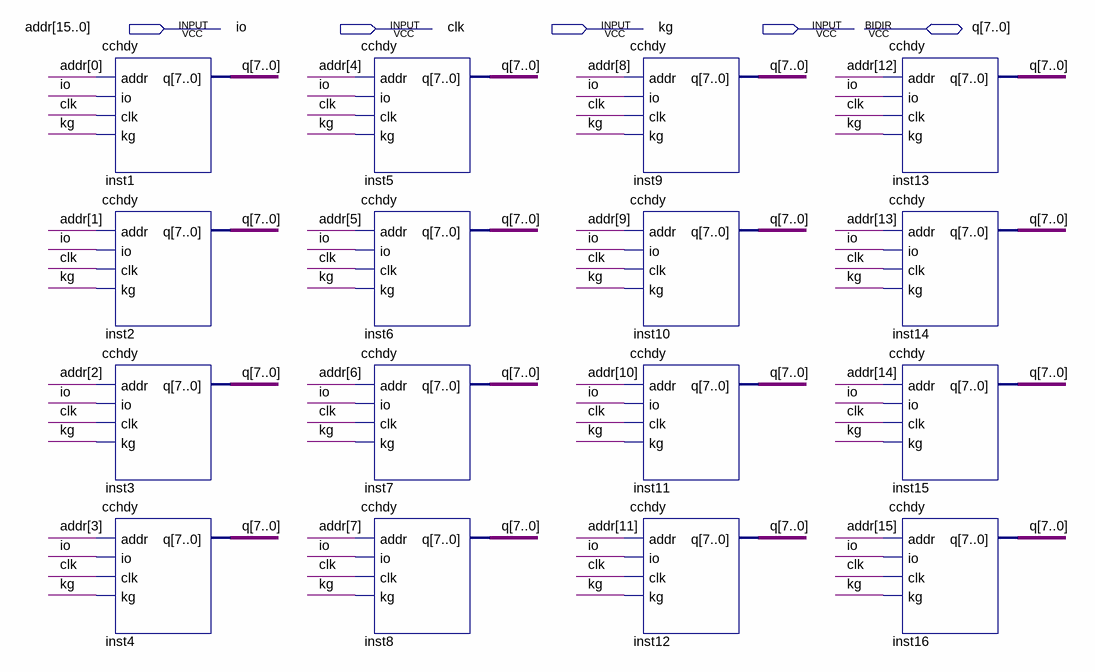
[diagram p0: schematic sheet]
// Quartus schematic cchq16.bdf as structural Verilog: 16 symbols, 5 pins
module cchq16 (
  input  [15:0] addr,
  input  io,
  input  clk,
  input  kg,
  inout  [7:0] q
);

  cchdy inst1 (.addr(addr[0]), .io(io), .clk(clk), .kg(kg), .q(q));
  cchdy inst2 (.addr(addr[1]), .io(io), .clk(clk), .kg(kg), .q(q));
  cchdy inst3 (.addr(addr[2]), .io(io), .clk(clk), .kg(kg), .q(q));
  cchdy inst4 (.addr(addr[3]), .io(io), .clk(clk), .kg(kg), .q(q));
  cchdy inst5 (.addr(addr[4]), .io(io), .clk(clk), .kg(kg), .q(q));
  cchdy inst6 (.addr(addr[5]), .io(io), .clk(clk), .kg(kg), .q(q));
  cchdy inst7 (.addr(addr[6]), .io(io), .clk(clk), .kg(kg), .q(q));
  cchdy inst8 (.addr(addr[7]), .io(io), .clk(clk), .kg(kg), .q(q));
  cchdy inst9 (.addr(addr[8]), .io(io), .clk(clk), .kg(kg), .q(q));
  cchdy inst10 (.addr(addr[9]), .io(io), .clk(clk), .kg(kg), .q(q));
  cchdy inst11 (.addr(addr[10]), .io(io), .clk(clk), .kg(kg), .q(q));
  cchdy inst12 (.addr(addr[11]), .io(io), .clk(clk), .kg(kg), .q(q));
  cchdy inst13 (.addr(addr[12]), .io(io), .clk(clk), .kg(kg), .q(q));
  cchdy inst14 (.addr(addr[13]), .io(io), .clk(clk), .kg(kg), .q(q));
  cchdy inst15 (.addr(addr[14]), .io(io), .clk(clk), .kg(kg), .q(q));
  cchdy inst16 (.addr(addr[15]), .io(io), .clk(clk), .kg(kg), .q(q));
endmodule
